# Altium project iMX6_Pixhawk.PrjPcb (part 6 of 6)
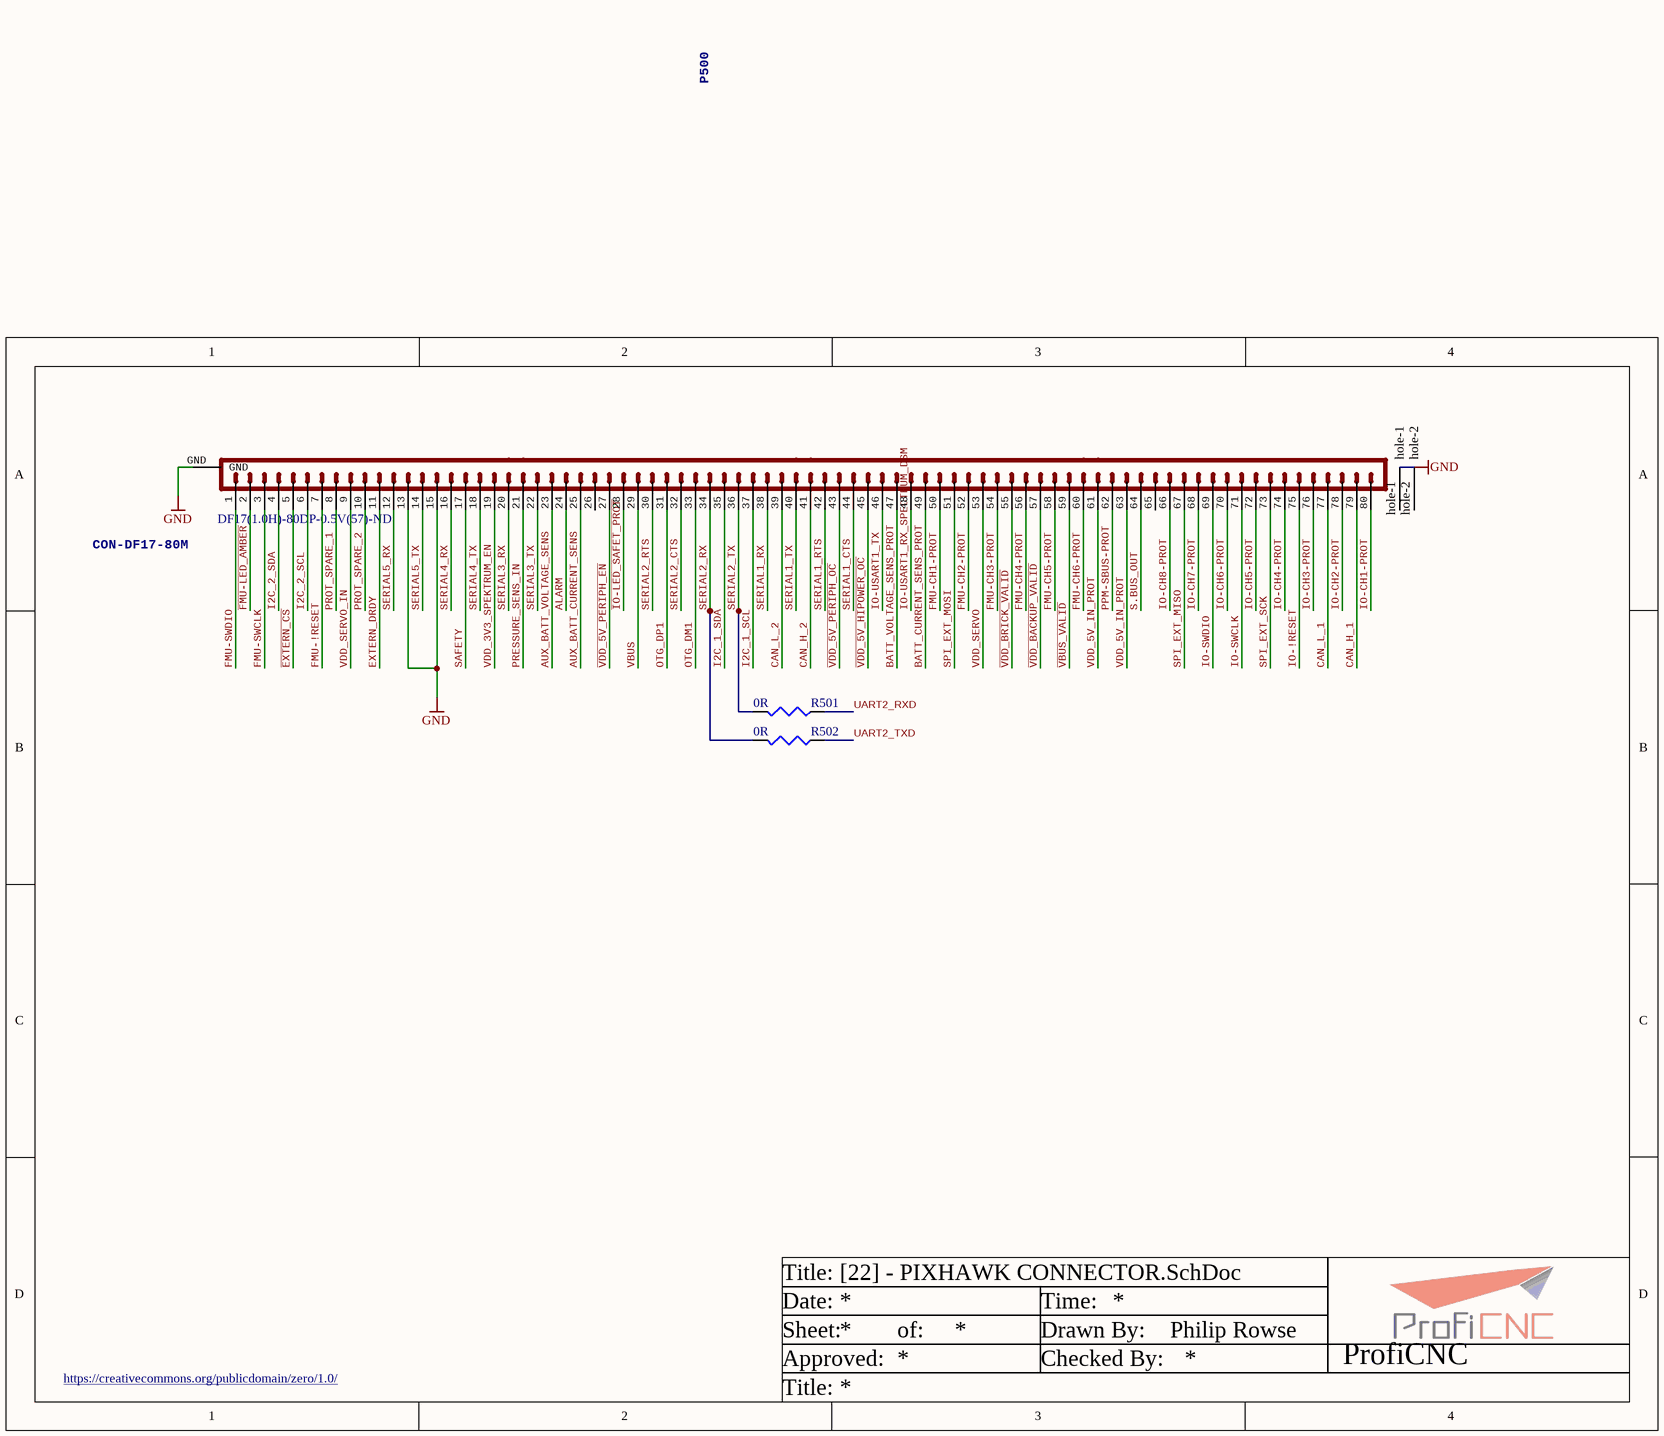
[diagram p26: [22] - PIXHAWK CONNECTOR.SchDoc]

## Nets that join several sheets
+2V5: [03] - CONNECTORS (C14.1 C232.1 J3.48 J3.58), [14] - PWR 5V, 3V3, 2V5 (6 pins)
+3V3: [03] - CONNECTORS (8 pins), [04] - VIDEO INPUT (6 pins), [05] - HDMI INPUT (D7.2 R11.2 R12.2 R13.2), [07] - PCIE MINI (FB9.1 R10.2 R37.2), [09] - USB (R65.2), [11] - SD CARD, BUFFERS (8 pins), [12] - UARTS (6 pins), [13] - HEADERS, SPI (C203.1 R204.1 R206.2 U8.8), [14] - PWR 5V, 3V3, 2V5 (9 pins), [15] - PWR IN, LEDS, BUTTONS, MECH (D5.2 D14.2 R140.2 R147.2), [16] - CAN BUS (C3004.P$1 U3004.3)
+5V: [03] - CONNECTORS (C15.1 C16.1 J1.76 J1.84), [04] - VIDEO INPUT (R104.1), [05] - HDMI INPUT (C71.1 D6.2 U4.1), [07] - PCIE MINI (FB7.1), [09] - USB (FB6.1 FB24.1), [14] - PWR 5V, 3V3, 2V5 (10 pins)
+5V_HDMI_IN_CON: [04] - VIDEO INPUT (R174.1), [05] - HDMI INPUT (6 pins)
+VIN: [03] - CONNECTORS (19 pins), [04] - VIDEO INPUT (5 pins), [07] - PCIE MINI (5 pins), [09] - USB (FB12.1), [14] - PWR 5V, 3V3, 2V5 (18 pins), [15] - PWR IN, LEDS, BUTTONS, MECH (C381.1 D1.3 TP9.1)
GND: [03] - CONNECTORS (74 pins), [04] - VIDEO INPUT (48 pins), [05] - HDMI INPUT (25 pins), [07] - PCIE MINI (47 pins), [09] - USB (16 pins), [11] - SD CARD, BUFFERS (11 pins), [12] - UARTS (8 pins), [13] - HEADERS, SPI (C203.2 JP1.2 U8.4 U8.9), [14] - PWR 5V, 3V3, 2V5 (53 pins), [15] - PWR IN, LEDS, BUTTONS, MECH (22 pins), [16] - CAN BUS (C3004.P$2 U3004.2 U3004.5 U3004.8), [17] - PLUGS (38 pins), [18] - POWER (9 pins), [19] - FTDI (13 pins), [20] - SERVO (5 pins), [21] - TEST POINTS (M3_MOUNT901.1 M3_MOUNT902.1 M3_MOUNT903.1 M3_MOUNT904.1), [22] - PIXHAWK CONNECTOR (P500.13 P500.15 P500.GND)
ALARM: [18] - POWER (PSM200.ALARM), [22] - PIXHAWK CONNECTOR (P500.24)
AUX_BATT_CURRENT_SENS: [18] - POWER (P202.3), [22] - PIXHAWK CONNECTOR (P500.25)
AUX_BATT_VOLTAGE_SENS: [18] - POWER (P202.4), [22] - PIXHAWK CONNECTOR (P500.23)
BATT_CURRENT_SENS_PROT: [18] - POWER (P200.3), [22] - PIXHAWK CONNECTOR (P500.49)
BATT_VOLTAGE_SENS_PROT: [18] - POWER (P200.4), [22] - PIXHAWK CONNECTOR (P500.47)
CAN_H_1: [16] - CAN BUS (R3010.P$1 U3004.7), [17] - PLUGS (P108.2), [22] - PIXHAWK CONNECTOR (P500.79)
CAN_H_2: [17] - PLUGS (P104.2), [22] - PIXHAWK CONNECTOR (P500.41)
CAN_L_1: [16] - CAN BUS (R3010.P$2 U3004.6), [17] - PLUGS (P108.3), [22] - PIXHAWK CONNECTOR (P500.77)
CAN_L_2: [17] - PLUGS (P104.3), [22] - PIXHAWK CONNECTOR (P500.39)
CSPI1_CLK: [03] - CONNECTORS (J2.23), [13] - HEADERS, SPI (U8.6)
CSPI1_CS0: [03] - CONNECTORS (J2.29), [13] - HEADERS, SPI (U8.1)
CSPI1_MISO: [03] - CONNECTORS (J2.27), [13] - HEADERS, SPI (U8.2)
CSPI1_MOSI: [03] - CONNECTORS (J2.25), [13] - HEADERS, SPI (U8.5)
~{EXTERN_CS}: [21] - TEST POINTS (SPI!CS1.P$1), [22] - PIXHAWK CONNECTOR (P500.5)
EXTERN_DRDY: [21] - TEST POINTS (D_RDY1.P$1), [22] - PIXHAWK CONNECTOR (P500.11)
~{FMU-LED_AMBER}: [18] - POWER (P201.6), [22] - PIXHAWK CONNECTOR (P500.2)
FLEXCAN1_RX: [03] - CONNECTORS (J2.32), [16] - CAN BUS (U3004.4)
FLEXCAN1_TX: [03] - CONNECTORS (J2.30), [16] - CAN BUS (U3004.1)
FMU-CH1-PROT: [20] - SERVO (P304.1), [22] - PIXHAWK CONNECTOR (P500.50)
FMU-CH2-PROT: [20] - SERVO (P304.2), [22] - PIXHAWK CONNECTOR (P500.52)
FMU-CH3-PROT: [20] - SERVO (P304.3), [22] - PIXHAWK CONNECTOR (P500.54)
FMU-CH4-PROT: [20] - SERVO (P304.4), [22] - PIXHAWK CONNECTOR (P500.56)
FMU-CH5-PROT: [20] - SERVO (P304.5), [22] - PIXHAWK CONNECTOR (P500.58)
FMU-CH6-PROT: [20] - SERVO (P304.6), [22] - PIXHAWK CONNECTOR (P500.60)
FMU-SWCLK: [17] - PLUGS (P106.5), [22] - PIXHAWK CONNECTOR (P500.3)
FMU-SWDIO: [17] - PLUGS (P106.4), [22] - PIXHAWK CONNECTOR (P500.1)
HDMI_IN_CEC_IN: [04] - VIDEO INPUT (R105.1), [05] - HDMI INPUT (R12.1 U4.16)
HDMI_IN_CLK_N: [04] - VIDEO INPUT (U1.C2), [05] - HDMI INPUT (J11.14 U4.15 U4.24)
HDMI_IN_CLK_P: [04] - VIDEO INPUT (U1.C1), [05] - HDMI INPUT (J11.12 U4.13 U4.26)
HDMI_IN_D0_N: [04] - VIDEO INPUT (U1.D2), [05] - HDMI INPUT (J11.11 U4.12 U4.27)
HDMI_IN_D0_P: [04] - VIDEO INPUT (U1.D1), [05] - HDMI INPUT (J11.9 U4.10 U4.29)
HDMI_IN_D1_N: [04] - VIDEO INPUT (U1.E2), [05] - HDMI INPUT (J11.8 U4.9 U4.30)
HDMI_IN_D1_P: [04] - VIDEO INPUT (U1.E1), [05] - HDMI INPUT (J11.6 U4.7 U4.32)
HDMI_IN_D2_N: [04] - VIDEO INPUT (U1.F2), [05] - HDMI INPUT (J11.5 U4.6 U4.33)
HDMI_IN_D2_P: [04] - VIDEO INPUT (U1.F1), [05] - HDMI INPUT (J11.3 U4.4 U4.35)
HDMI_IN_HPD: [04] - VIDEO INPUT (R165.1), [05] - HDMI INPUT (R13.1 U4.19)
I2C2_DDC_SCL: [04] - VIDEO INPUT (R6.1 R9.2 U1.A3), [05] - HDMI INPUT (U4.17)
I2C2_DDC_SDA: [04] - VIDEO INPUT (R7.1 R8.2 U1.B3), [05] - HDMI INPUT (U4.18)
I2C2_SCL: [03] - CONNECTORS (J2.48), [04] - VIDEO INPUT (R9.1), [07] - PCIE MINI (J13.30)
I2C2_SDA: [03] - CONNECTORS (J2.50), [04] - VIDEO INPUT (R8.1), [07] - PCIE MINI (J13.32)
I2C3_SCL: [03] - CONNECTORS (J2.54), [04] - VIDEO INPUT (U1.B8)
I2C3_SDA: [03] - CONNECTORS (J2.52), [04] - VIDEO INPUT (U1.B7)
I2C_1_SCL: [17] - PLUGS (P107.4), [22] - PIXHAWK CONNECTOR (P500.37)
I2C_1_SDA: [17] - PLUGS (P107.5), [22] - PIXHAWK CONNECTOR (P500.35)
I2C_2_SCL: [17] - PLUGS (P102.2 P109.4), [22] - PIXHAWK CONNECTOR (P500.6)
I2C_2_SDA: [17] - PLUGS (P102.3 P109.5), [22] - PIXHAWK CONNECTOR (P500.4)
~{IO-LED_SAFET_PROT}: [17] - PLUGS (P107.7), [22] - PIXHAWK CONNECTOR (P500.28)
IO-CH1-PROT: [20] - SERVO (P304.7), [22] - PIXHAWK CONNECTOR (P500.80)
IO-CH2-PROT: [20] - SERVO (P304.8), [22] - PIXHAWK CONNECTOR (P500.78)
IO-CH3-PROT: [20] - SERVO (P304.9), [22] - PIXHAWK CONNECTOR (P500.76)
IO-CH4-PROT: [20] - SERVO (P304.10), [22] - PIXHAWK CONNECTOR (P500.74)
IO-CH5-PROT: [20] - SERVO (P304.11), [22] - PIXHAWK CONNECTOR (P500.72)
IO-CH6-PROT: [20] - SERVO (P304.12), [22] - PIXHAWK CONNECTOR (P500.70)
IO-CH7-PROT: [20] - SERVO (P304.13), [22] - PIXHAWK CONNECTOR (P500.68)
IO-CH8-PROT: [20] - SERVO (P304.14), [22] - PIXHAWK CONNECTOR (P500.66)
IO-SWCLK: [17] - PLUGS (P105.5), [22] - PIXHAWK CONNECTOR (P500.71)
IO-SWDIO: [17] - PLUGS (P105.4), [22] - PIXHAWK CONNECTOR (P500.69)
IO-USART1_RX_SPECTRUM_DSM: [17] - PLUGS (JP100.1 P105.3 SPKT100.1), [22] - PIXHAWK CONNECTOR (P500.48)
IO-USART1_TX: [17] - PLUGS (P105.2), [22] - PIXHAWK CONNECTOR (P500.46)
NetC198_1: [11] - SD CARD, BUFFERS (U21.2), [15] - PWR IN, LEDS, BUTTONS, MECH (C198.1 R141.1)
NetC200_1: [03] - CONNECTORS (J2.10), [15] - PWR IN, LEDS, BUTTONS, MECH (C200.1 R149.1)
NetJ1_38: [03] - CONNECTORS (J1.38), [09] - USB (R67.2 R304.2)
NetJ1_40: [03] - CONNECTORS (J1.40), [07] - PCIE MINI (R22.2)
NetJ1_82: [03] - CONNECTORS (J1.82), [15] - PWR IN, LEDS, BUTTONS, MECH (Q5.1)
NetJ2_2: [03] - CONNECTORS (J2.2), [11] - SD CARD, BUFFERS (U21.4)
NetJ2_3: [03] - CONNECTORS (J2.3), [13] - HEADERS, SPI (JP1.1)
NetJ2_4: [03] - CONNECTORS (J2.4), [11] - SD CARD, BUFFERS (U20.1 U20.2)
NetJ2_7: [03] - CONNECTORS (J2.7), [14] - PWR 5V, 3V3, 2V5 (R26.1 U9.14)
NetJ2_9: [03] - CONNECTORS (J2.9), [04] - VIDEO INPUT (U2.5), [14] - PWR 5V, 3V3, 2V5 (U10.14)
NetJ2_14: [03] - CONNECTORS (J2.14), [04] - VIDEO INPUT (R167.2)
NetJ2_16: [03] - CONNECTORS (J2.16), [04] - VIDEO INPUT (R166.2)
NetJ2_18: [03] - CONNECTORS (J2.18), [04] - VIDEO INPUT (R168.2)
NetJ2_22: [03] - CONNECTORS (J2.22), [04] - VIDEO INPUT (R169.2)
NetJ13_22: [07] - PCIE MINI (J13.22), [09] - USB (R155.2), [11] - SD CARD, BUFFERS (R64.2 U20.4)
NetQ4_1: [04] - VIDEO INPUT (R5.2), [07] - PCIE MINI (R153.2), [11] - SD CARD, BUFFERS (R117.1 U21.1), [15] - PWR IN, LEDS, BUTTONS, MECH (Q4.1)
NetR5_1: [04] - VIDEO INPUT (R5.1 R81.1 U2.3), [07] - PCIE MINI (U6.5)
OTG_DM1: [18] - POWER (P201.3), [22] - PIXHAWK CONNECTOR (P500.33)
OTG_DP1: [18] - POWER (P201.2), [22] - PIXHAWK CONNECTOR (P500.31)
PCIE_CLK_N: [03] - CONNECTORS (J2.80), [07] - PCIE MINI (J13.11)
PCIE_CLK_P: [03] - CONNECTORS (J2.82), [07] - PCIE MINI (J13.13)
PCIE_RX_N: [03] - CONNECTORS (J2.85), [07] - PCIE MINI (J13.23)
PCIE_RX_P: [03] - CONNECTORS (J2.87), [07] - PCIE MINI (J13.25)
PCIE_TX_N: [03] - CONNECTORS (J2.79), [07] - PCIE MINI (J13.31)
PCIE_TX_P: [03] - CONNECTORS (J2.81), [07] - PCIE MINI (J13.33)
PCIE_WAKE: [03] - CONNECTORS (J2.76), [07] - PCIE MINI (J13.1 R37.1)
POK_1V5_MODULE: [03] - CONNECTORS (J2.5), [14] - PWR 5V, 3V3, 2V5 (R31.1 R220.1)
PPM-SBUS-PROT: [20] - SERVO (P304.15), [22] - PIXHAWK CONNECTOR (P500.62)
PRESSURE_SENS_IN: [17] - PLUGS (P101.2), [21] - TEST POINTS (ADC_PR.P$1), [22] - PIXHAWK CONNECTOR (P500.21)
RX_5V0_OUT: [18] - POWER (PSM200.RX), [20] - SERVO (P304.RX 5V)
S.BUS_OUT: [20] - SERVO (P301.1), [22] - PIXHAWK CONNECTOR (P500.64)
SAFETY: [17] - PLUGS (P107.6), [22] - PIXHAWK CONNECTOR (P500.17)
SD3_CD: [03] - CONNECTORS (J2.33), [11] - SD CARD, BUFFERS (Q3.3)
SD3_CLK: [03] - CONNECTORS (J2.37), [11] - SD CARD, BUFFERS (J15.5)
SD3_CMD: [03] - CONNECTORS (J2.39), [11] - SD CARD, BUFFERS (J15.3)
SD3_DATA0: [03] - CONNECTORS (J2.43), [11] - SD CARD, BUFFERS (J15.7)
SD3_DATA1: [03] - CONNECTORS (J2.45), [11] - SD CARD, BUFFERS (J15.8)
SD3_DATA2: [03] - CONNECTORS (J2.47), [11] - SD CARD, BUFFERS (J15.1)
SD3_DATA3: [03] - CONNECTORS (J2.49), [11] - SD CARD, BUFFERS (J15.2)
SD3_WP: [03] - CONNECTORS (J2.35), [11] - SD CARD, BUFFERS (R139.2)
SERIAL1_CTS: [17] - PLUGS (P100.4), [22] - PIXHAWK CONNECTOR (P500.44)
SERIAL1_RTS: [17] - PLUGS (P100.5), [22] - PIXHAWK CONNECTOR (P500.42)
SERIAL1_RX: [17] - PLUGS (JP100.2 P100.3), [21] - TEST POINTS (S1RX.P$1), [22] - PIXHAWK CONNECTOR (P500.38)
SERIAL1_TX: [17] - PLUGS (P100.2), [21] - TEST POINTS (S1TX.P$1), [22] - PIXHAWK CONNECTOR (P500.40)
SERIAL2_CTS: [17] - PLUGS (P103.4), [22] - PIXHAWK CONNECTOR (P500.32)
SERIAL2_RTS: [17] - PLUGS (P103.5), [22] - PIXHAWK CONNECTOR (P500.30)
SERIAL2_RX: [17] - PLUGS (P103.3), [21] - TEST POINTS (S2RX.P$1), [22] - PIXHAWK CONNECTOR (P500.34 R502.2)
SERIAL2_TX: [17] - PLUGS (P103.2), [21] - TEST POINTS (S2TX.P$1), [22] - PIXHAWK CONNECTOR (P500.36 R501.2)
SERIAL3_RX: [17] - PLUGS (P107.3), [21] - TEST POINTS (S3RX.P$1), [22] - PIXHAWK CONNECTOR (P500.20)
SERIAL3_TX: [17] - PLUGS (P107.2), [21] - TEST POINTS (S3TX.P$1), [22] - PIXHAWK CONNECTOR (P500.22)
SERIAL4_RX: [17] - PLUGS (P109.3), [21] - TEST POINTS (S4RX.P$1), [22] - PIXHAWK CONNECTOR (P500.16)
SERIAL4_TX: [17] - PLUGS (P109.2), [21] - TEST POINTS (S4TX.P$1), [22] - PIXHAWK CONNECTOR (P500.18)
SERIAL5_RX: [17] - PLUGS (P106.3), [20] - SERVO (P301.4), [21] - TEST POINTS (S5_RX.P$1), [22] - PIXHAWK CONNECTOR (P500.12)
SERIAL5_TX: [17] - PLUGS (P106.2), [20] - SERVO (P301.2), [21] - TEST POINTS (S5_TX.P$1), [22] - PIXHAWK CONNECTOR (P500.14)
SPI_EXT_MISO: [21] - TEST POINTS (SPI_MISO1.P$1), [22] - PIXHAWK CONNECTOR (P500.67)
SPI_EXT_MOSI: [21] - TEST POINTS (SPI_MOSI1.P$1), [22] - PIXHAWK CONNECTOR (P500.51)
SPI_EXT_SCK: [21] - TEST POINTS (SPI_SCK1.P$1), [22] - PIXHAWK CONNECTOR (P500.73)
UART1_RXD: [03] - CONNECTORS (J2.55), [12] - UARTS (Q8.1 R54.1 R58.1)
UART1_RXD_FTDI: [12] - UARTS (D4.1 Q8.6 R58.2), [19] - FTDI (U603.30)
UART1_TXD: [03] - CONNECTORS (J2.53), [12] - UARTS (Q6.4 R59.1 R70.1)
UART1_TXD_FTDI: [12] - UARTS (D8.1 Q6.3 R55.1 R59.2), [19] - FTDI (U603.2)
UART2_RXD: [03] - CONNECTORS (J2.63), [22] - PIXHAWK CONNECTOR (R501.1)
UART2_TXD: [03] - CONNECTORS (J2.61), [22] - PIXHAWK CONNECTOR (R502.1)
UART4_RXD: [03] - CONNECTORS (J2.60), [12] - UARTS (P1.3)
UART4_TXD: [03] - CONNECTORS (J2.58), [12] - UARTS (P1.2)
UART5_RXD: [03] - CONNECTORS (J2.64), [12] - UARTS (P2.3)
UART5_TXD: [03] - CONNECTORS (J2.62), [12] - UARTS (P2.2)
USB0_ID: [03] - CONNECTORS (J2.68), [09] - USB (5 pins)
USB0_N: [03] - CONNECTORS (J2.73), [09] - USB (L8.2)
USB0_P: [03] - CONNECTORS (J2.75), [09] - USB (L8.1)
USB1_N: [03] - CONNECTORS (J2.67), [07] - PCIE MINI (L6.3)
USB1_P: [03] - CONNECTORS (J2.69), [07] - PCIE MINI (L6.4)
~{VBUS_VALID}: [18] - POWER (PSM200.!VBUS_VALID), [22] - PIXHAWK CONNECTOR (P500.59)
~{VDD_5V_HIPOWER_OC}: [18] - POWER (PSM200.!VDD_5V_HIPOWER_OC), [22] - PIXHAWK CONNECTOR (P500.45)
~{VDD_5V_PERIPH_EN}: [18] - POWER (PSM200.!VDD_5V_PERIPH_EN), [22] - PIXHAWK CONNECTOR (P500.27)
~{VDD_5V_PERIPH_OC}: [18] - POWER (PSM200.!VDD_5V_PERIPH_OC), [22] - PIXHAWK CONNECTOR (P500.43)
~{VDD_BACKUP_VALID}: [18] - POWER (PSM200.!VDD_BACKUP_VALID), [22] - PIXHAWK CONNECTOR (P500.57)
~{VDD_BRICK_VALID}: [18] - POWER (PSM200.!VDD_BRICK_VALID), [22] - PIXHAWK CONNECTOR (P500.55)
VBUS: [18] - POWER (P201.1 PSM200.VBUS PSM200.VDD_VBUS), [22] - PIXHAWK CONNECTOR (P500.29)
VDD_3V3_SPEKTRUM: [17] - PLUGS (D102.C SPKT100.3), [18] - POWER (PSM200.SPEK)
VDD_3V3_SPEKTRUM_EN: [18] - POWER (PSM200.VDD_3V3_SPEKTRUM_EN), [22] - PIXHAWK CONNECTOR (P500.19)
VDD_5V_HIPOWER: [17] - PLUGS (L101.P$1), [18] - POWER (PSM200.5V_HIPOWER)
VDD_5V_IN_PROT: [18] - POWER (PSM200.VDD_5V_IN_PROT), [22] - PIXHAWK CONNECTOR (P500.61 P500.63)
VDD_5V_PERIPH: [17] - PLUGS (9 pins), [18] - POWER (PSM200.5V_PERIPH)
VDD_SERVO: [20] - SERVO (D300.ANODE P301.3 P304.SERVO VCC), [22] - PIXHAWK CONNECTOR (P500.53)
VDD_SERVO_IN: [18] - POWER (PSM200.SERVO_IN), [20] - SERVO (L300.P$2), [22] - PIXHAWK CONNECTOR (P500.9)
VID_IN_CSI0_D0: [03] - CONNECTORS (J1.48), [04] - VIDEO INPUT (R1.2 TP2.1)
VID_IN_CSI0_D1: [03] - CONNECTORS (J1.50), [04] - VIDEO INPUT (R2.2 TP3.1)
VID_IN_CSI0_D2: [03] - CONNECTORS (J1.52), [04] - VIDEO INPUT (U1.F10)
VID_IN_CSI0_D3: [03] - CONNECTORS (J1.54), [04] - VIDEO INPUT (U1.G9)
VID_IN_CSI0_D4: [03] - CONNECTORS (J1.51), [04] - VIDEO INPUT (U1.G10)
VID_IN_CSI0_D5: [03] - CONNECTORS (J1.53), [04] - VIDEO INPUT (U1.H9)
VID_IN_CSI0_D6: [03] - CONNECTORS (J1.55), [04] - VIDEO INPUT (U1.H10)
VID_IN_CSI0_D7: [03] - CONNECTORS (J1.57), [04] - VIDEO INPUT (U1.J9)
VID_IN_CSI0_D8: [03] - CONNECTORS (J1.58), [04] - VIDEO INPUT (U1.K9)
VID_IN_CSI0_D9: [03] - CONNECTORS (J1.60), [04] - VIDEO INPUT (U1.J8)
VID_IN_CSI0_D10: [03] - CONNECTORS (J1.62), [04] - VIDEO INPUT (R3.2 TP5.1)
VID_IN_CSI0_D11: [03] - CONNECTORS (J1.64), [04] - VIDEO INPUT (R4.2 TP6.1)
VID_IN_CSI0_D12: [03] - CONNECTORS (J1.61), [04] - VIDEO INPUT (U1.K8)
VID_IN_CSI0_D13: [03] - CONNECTORS (J1.63), [04] - VIDEO INPUT (U1.J7)
VID_IN_CSI0_D14: [03] - CONNECTORS (J1.65), [04] - VIDEO INPUT (U1.K7)
VID_IN_CSI0_D15: [03] - CONNECTORS (J1.67), [04] - VIDEO INPUT (U1.J6)
VID_IN_CSI0_D16: [03] - CONNECTORS (J1.68), [04] - VIDEO INPUT (U1.K6)
VID_IN_CSI0_D17: [03] - CONNECTORS (J1.70), [04] - VIDEO INPUT (U1.J5)
VID_IN_CSI0_D18: [03] - CONNECTORS (J1.72), [04] - VIDEO INPUT (U1.K5)
VID_IN_CSI0_D19: [03] - CONNECTORS (J1.74), [04] - VIDEO INPUT (U1.J4)
VID_IN_CSI0_DE: [03] - CONNECTORS (J1.75), [04] - VIDEO INPUT (U1.E10)
VID_IN_CSI0_HS: [03] - CONNECTORS (J1.47), [04] - VIDEO INPUT (U1.F9)
VID_IN_CSI0_INT: [03] - CONNECTORS (J1.73), [04] - VIDEO INPUT (R109.1)
VID_IN_CSI0_PIXCLK: [03] - CONNECTORS (J1.43), [04] - VIDEO INPUT (R66.1)
VID_IN_CSI0_RSTn: [03] - CONNECTORS (J1.71), [04] - VIDEO INPUT (U1.B6)
VID_IN_CSI0_VS: [03] - CONNECTORS (J1.45), [04] - VIDEO INPUT (U1.E9)

## Assembly variants
PCA_0005_Normal_CB: not fitted 3DR_LOGO1 3DR_LOGO2 3DR_LOGO3 ADC_PR BATT600 C600 C601 C602 C603 C604 C605 D_RDY1 EDISON600 JP400 JP401 L600 L601 LED600 LED601 LV600 LV601 LV602 LV603 LV604 LV605 M3_MOUNT901 M3_MOUNT902 M3_MOUNT903 M3_MOUNT904 Nut 600 Nut 601 P600 R600 R603 R605 R606 R607 R608 R609 R610 R611 R612 R613 S1RX S1TX S2RX S2TX S3RX S3TX S4RX S4TX S5_RX S5_TX S600 S601 S602 SPI!CS1 SPI_MISO1 SPI_MOSI1 SPI_SCK1 U601 U603 USB600 USB601
PCA_0012_INTEL_CB: not fitted EDISON600 JP400 JP401 M3_MOUNT901 M3_MOUNT902 M3_MOUNT903 M3_MOUNT904 S1RX S1TX S2RX S2TX S3RX S3TX S4RX S4TX S5_RX S5_TX